# Altium schematic sheet IR.SchDoc
size A; SheetNumber: 8
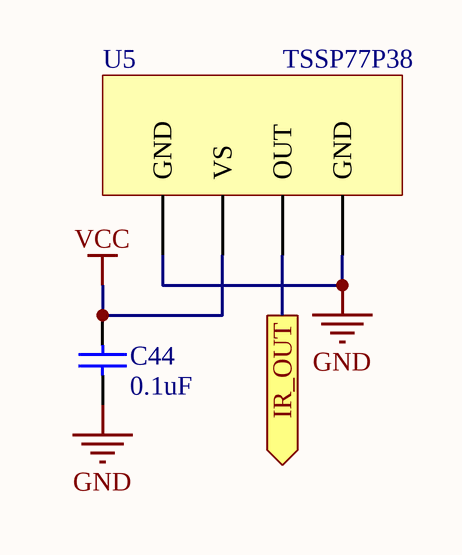
[diagram p0: IR.SchDoc]

## Parts
C44  value 0.1uF  [C0402[1005X55]]  (hidden comment: 0.1uF 6.3V 0402)
U5  TSSP77P38  [TSSP77P38]

## Ports
IR_OUT (out)

## Nets
GND: C44.1 U5.1(GND) U5.4(GND)
VCC: C44.2 U5.2(VS)
IR_OUT: U5.3(OUT) ; port IR_OUT

## Library data of the parts
C44 = CAP_0.1uF_6.3V_0402_10%: 0.1uF 6.3V 10% 0402 (1005 Metric); PartNumber: GRM155R70J104KA01D; Manufacturer: Murata; Mounting Technology: Surface Mount; PackageReference: 0402; PackageDescription: 0402 (1005 Metric); Voltage: 6.3V; Tolerance: 10%
U5 = TSSP77P38: Manufacturer: Vishay; PartNumber: TSSP77P38; Mounting Technology: Surface Mount